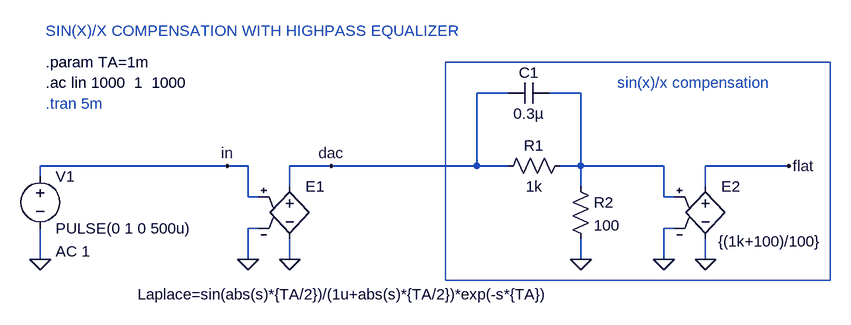
[diagram p0: schematic sinx_x_equalizer1.asc]
sinx_x_equalizer1.asc, the LTspice schematic file:
Version 4
SHEET 1 1476 680
WIRE 640 -64 592 -64
WIRE 752 -64 704 -64
WIRE 208 48 -80 48
WIRE 240 48 208 48
WIRE 368 48 304 48
WIRE 592 48 592 -64
WIRE 592 48 368 48
WIRE 640 48 592 48
WIRE 752 48 752 -64
WIRE 752 48 720 48
WIRE 880 48 752 48
WIRE 1072 48 944 48
WIRE -80 64 -80 48
WIRE 304 80 304 48
WIRE 752 80 752 48
WIRE 944 80 944 48
WIRE 240 96 240 48
WIRE 256 96 240 96
WIRE 880 96 880 48
WIRE 896 96 880 96
WIRE 256 144 240 144
WIRE 896 144 880 144
WIRE -80 192 -80 144
WIRE 240 192 240 144
WIRE 304 192 304 160
WIRE 752 192 752 160
WIRE 880 192 880 144
WIRE 944 192 944 160
FLAG -80 192 0
FLAG 304 192 0
FLAG 368 48 dac
FLAG 240 192 0
FLAG 208 48 in
FLAG 752 192 0
FLAG 1072 48 flat
FLAG 944 192 0
FLAG 880 192 0
SYMBOL voltage -80 48 R0
WINDOW 123 24 132 Left 0
WINDOW 39 0 0 Left 0
SYMATTR InstName V1
SYMATTR Value PULSE(0 1 0 500u)
SYMATTR Value2 AC 1
SYMBOL E 304 64 R0
WINDOW 123 24 132 Left 0
WINDOW 3 -234 182 Left 0
SYMATTR InstName E1
SYMATTR Value Laplace=sin(abs(s)*{TA/2})/(1u+abs(s)*{TA/2})*exp(-s*{TA})
SYMBOL res 624 64 R270
WINDOW 0 32 56 VTop 0
WINDOW 3 0 56 VBottom 0
SYMATTR InstName R1
SYMATTR Value 1k
SYMBOL res 736 64 R0
SYMATTR InstName R2
SYMATTR Value 100
SYMBOL cap 640 -48 R270
WINDOW 0 32 32 VTop 0
WINDOW 3 0 32 VBottom 0
SYMATTR InstName C1
SYMATTR Value 0.3µ
SYMBOL E 944 64 R0
WINDOW 123 24 132 Left 0
WINDOW 3 20 100 Left 0
SYMATTR InstName E2
SYMATTR Value {(1k+100)/100}
TEXT -72 -80 Left 0 !.ac lin 1000  1  1000
TEXT -72 -48 Left 0 ;.tran 5m
TEXT 808 -80 Left 0 ;sin(x)/x compensation
TEXT -72 -112 Left 0 !.param TA=1m
TEXT -72 -160 Left 0 ;SIN(X)/X COMPENSATION WITH HIGHPASS EQUALIZER
RECTANGLE Normal 1136 224 544 -112

The netlist it stands for:
* sinx_x_equalizer1.asc
V1 in 0 PULSE(0 1 0 500u) AC 1
E1 dac 0 in 0 Laplace=sin(abs(s)*{TA/2})/(1u+abs(s)*{TA/2})*exp(-s*{TA})
R1 dac N001 1k
R2 N001 0 100
C1 dac N001 0.3µ
E2 flat 0 N001 0 {(1k+100)/100}
.ac lin 1000  1  1000
* .tran 5m
* sin(x)/x compensation
.param TA=1m
* SIN(X)/X COMPENSATION WITH HIGHPASS EQUALIZER
.backanno
.end